# EAGLE design speaker-lights (EAGLE 9.6.2)
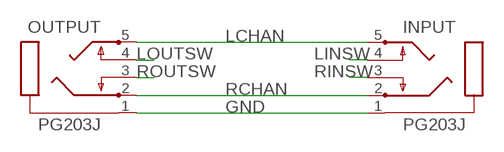
[diagram p0: schematic, sheet 1]

## Parts
INPUT  PG203J  [PG203J]
OUTPUT  PG203J  [PG203J]

## Nets
GND: INPUT.1 OUTPUT.1
LCHAN: INPUT.5 OUTPUT.5
LINSW: INPUT.4
LOUTSW: OUTPUT.4
RCHAN: INPUT.2 OUTPUT.2
RINSW: INPUT.3
ROUTSW: OUTPUT.3

## Library data of the parts
INPUT OUTPUT = con-hirschmann:PG203J: MIC/HEADPHONE JACK KS-S stereo microphone/headphone jack PG203JN (Schukat); OC_FARNELL: unknown; OC_NEWARK: unknown

## Board
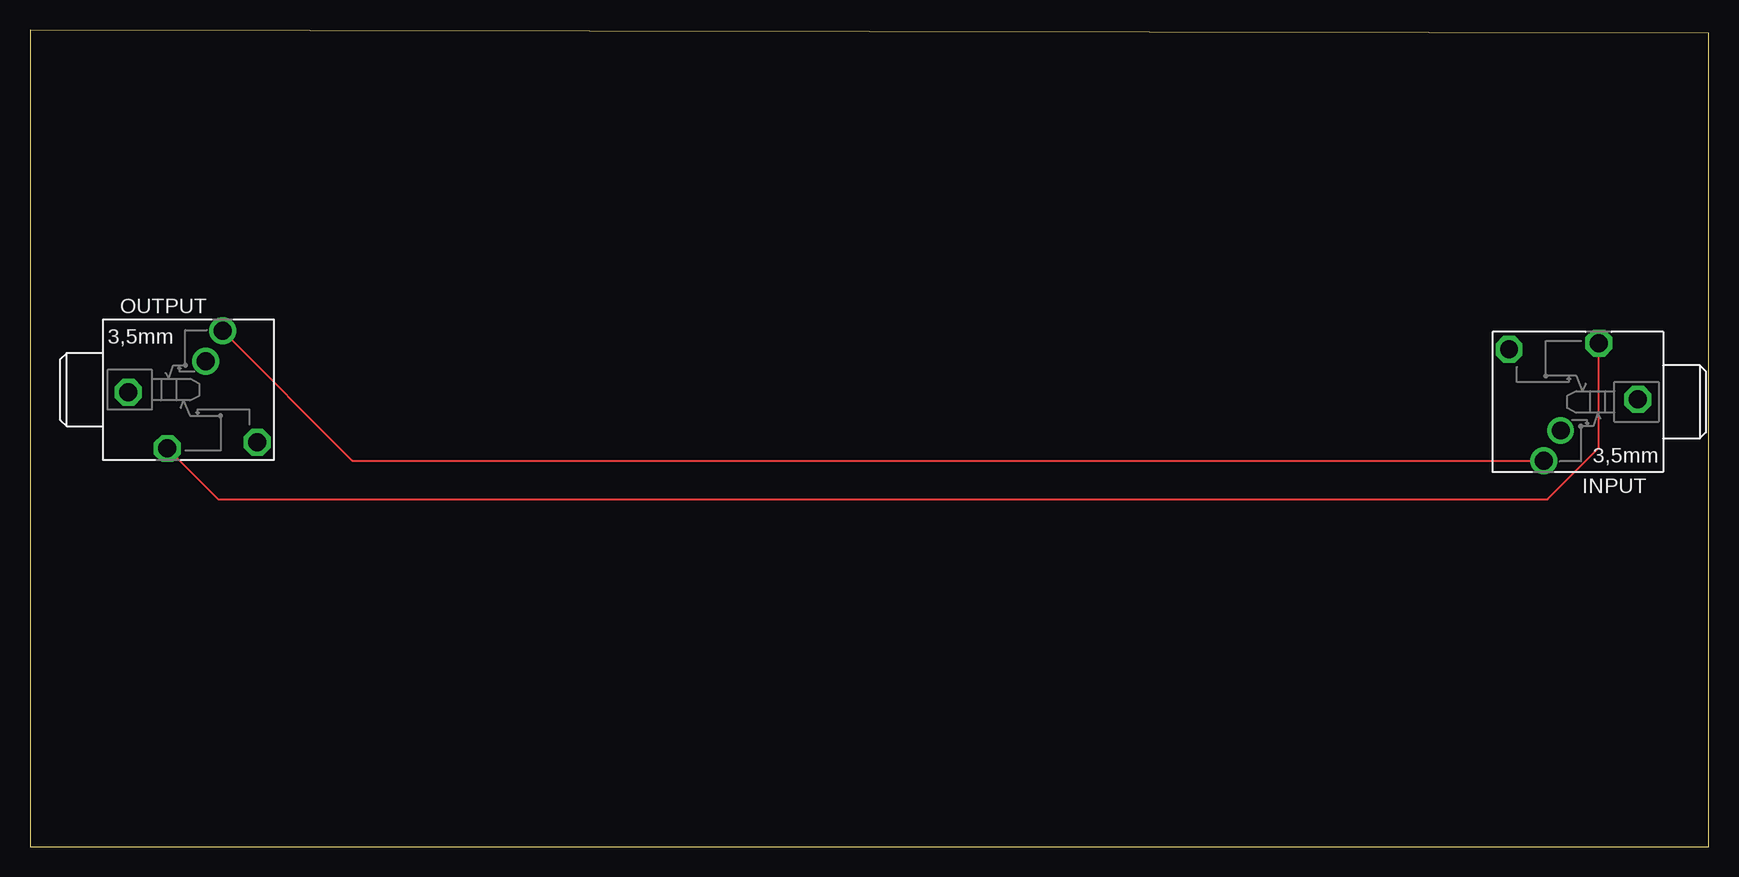
[diagram p1: board, top side]
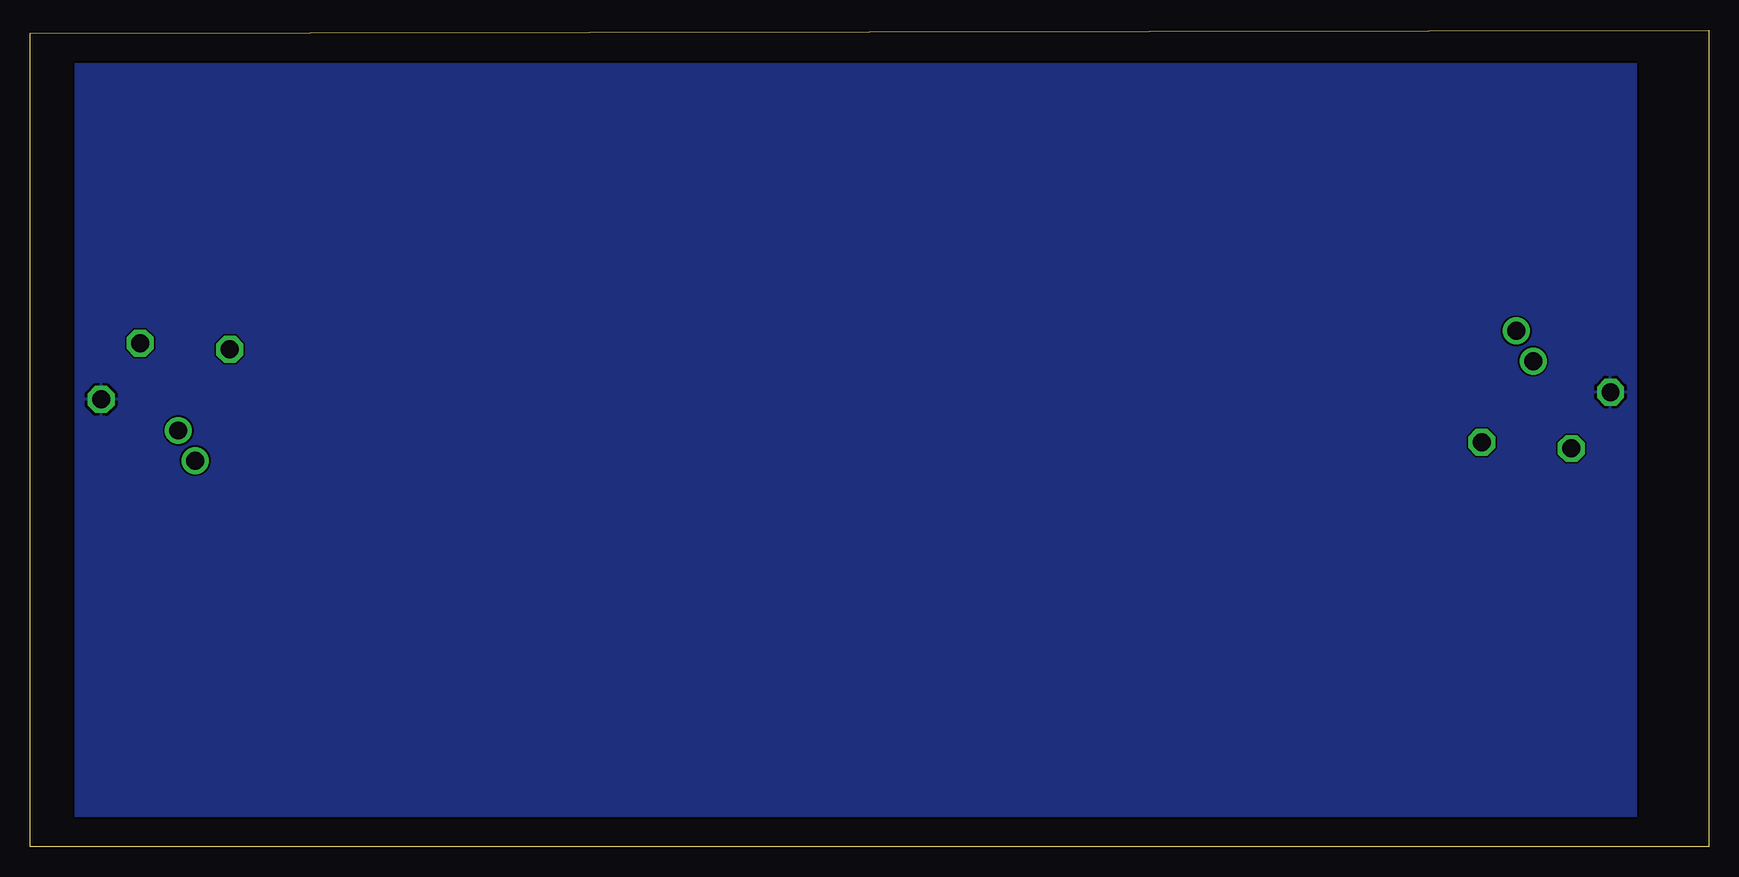
[diagram p2: board, bottom side, seen from below]

Size 139.95 x 68.07 mm. Coordinates in mm from the lower left corner, seen from the top.
Outline: 0,0 139.95,0 139.95,67.82 0,68.07 0,0
Copper layers (1*16): Top 0.035mm / dielectric 1.5mm / Bottom 0.035mm
Design rules "default": minimum track width 6mil, minimum drill 0.35mm, track to track 6mil, track to pad 6mil, pad to pad 6mil, via to via 6mil, smd to smd 6mil, copper to edge 40mil, drill to drill 6mil, minimum pad ring 10mil, minimum via ring 8mil, stop-mask expansion 4mil, vias tented up to drill 0mil, thermal gap 10mil

### Footprints (pad centres in the part's own frame; a part is rotated, then mirrored left to right if it is on the bottom)
PG203J = drill 1.499 octagon: 1 -5.004,-0.203; 4 5.74,-4.369; 5 -1.753,-4.902 | drill 1.499: 2 2.845,4.902; 3 1.448,2.388

### Placement (x,y rotation side)
INPUT  129.03,37.08 180 top
OUTPUT  13.21,38.1 0 top

### Tracks (layer width: path | path; a pad name or v marks a point on that pad's centre or on a via)
GND
  pour Bottom: 6.1,37.85 6.1,2.54 136.14,2.54 136.14,65.28 6.1,65.28
LCHAN
  Top 0.152: OUTPUT.5 15.7,28.96 126.49,28.96 130.78,33.25 INPUT.5
RCHAN
  Top 0.152: OUTPUT.2 26.87,32.18 INPUT.2